# Altium schematic sheet Power.SchDoc
size A4
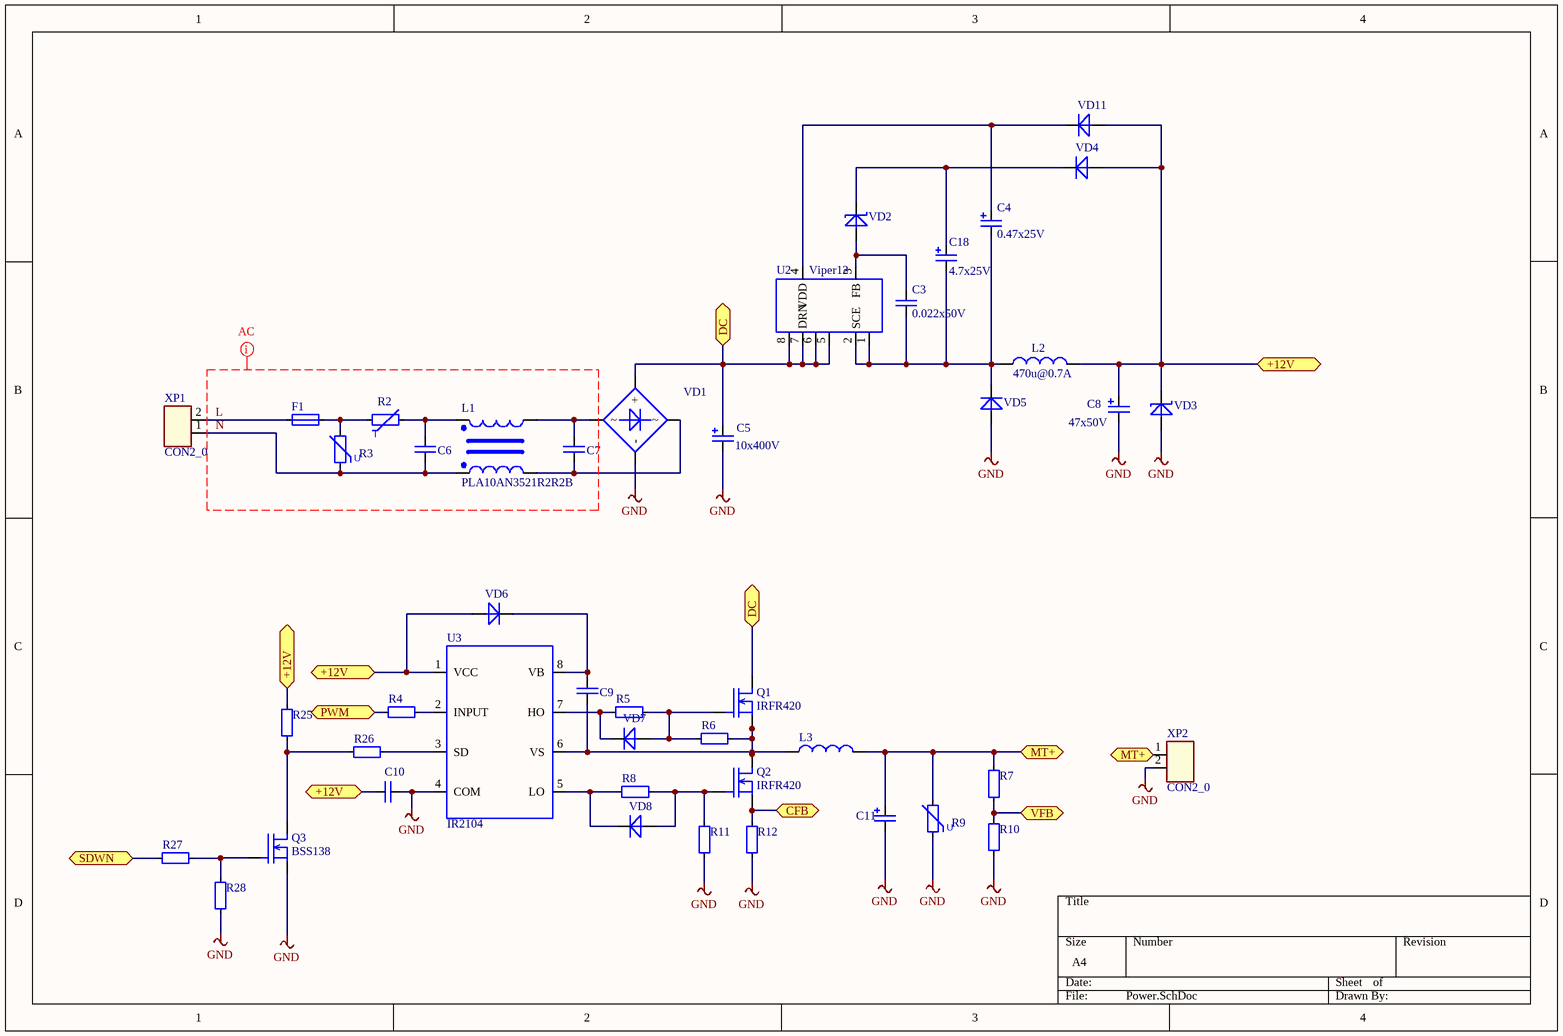
[diagram p0: Power.SchDoc]

## Parts
C3  0.022x50V  [SMD_0805]
C4  0.47x25V  [CAPR-5/2.5]
C5  10x400V  [CAPR-10/5]
C6  (no value)  [MKR-X2-0.22-10]
C7  (no value)  [MKR-X2-0.22-10]
C8  47x50V  [CAPR-5/2.5]
C9  (no value)  [SMD_0805]
C10  (no value)  [SMD_0805]
C11  (no value)  [CAPR-5/2.5]
C18  4.7x25V  [CAPR-5/2.5]
F1  (no value)  [KLS-1009]
L1  PLA10AN3521R2R2B  [PLA10AN3521R2R2B]
L2  470u@0.7A  [IND-DV0470.00K]
L3  (no value)  [IND-DV0470.00K]
Q1  IRFR420  [TO-252]
Q2  IRFR420  [TO-252]
Q3  BSS138  [SOT23-3PIN]
R2  RES NTC  [NTC-5mm]  (value not drawn)
R3  RES VARISTOR  [VAR-10D]  (value not drawn)
R4  (no value)  [SMD_0805]
R5  (no value)  [SMD_0805]
R6  (no value)  [SMD_0805]
R7  (no value)  [SMD_0805]
R8  (no value)  [SMD_0805]
R9  RES VARISTOR  [VAR-05D]  (value not drawn)
R10  (no value)  [SMD_0805]
R11  (no value)  [SMD_0805]
R12  (no value)  [SMD_0805]
R25  (no value)  [SMD_0805]
R26  (no value)  [SMD_0805]
R27  (no value)  [SMD_0805]
R28  (no value)  [SMD_0805]
U2  Viper12  [SO8-150mil]
U3  IR2104  [SO8-150mil]
VD1  DIODE BRIDGE  [GBU BRIDGE]  (value not drawn)
VD2  (no value)  [SOD-123]
VD3  (no value)  [SOD-123]
VD4  (no value)  [DO214-AC]
VD5  (no value)  [DO214-AC]
VD6  (no value)  [DO214-AC]
VD7  (no value)  [DIO-MELF_SOD-80]
VD8  (no value)  [DIO-MELF_SOD-80]
VD11  (no value)  [DO214-AC]
XP1  CON2_0  [SCREW_TERM-5.0/2]
XP2  CON2_0  [SCREW_TERM-5.0/2]

## Ports
+12V, CFB, DC, MT+, PWM, SDWN, VFB

## Nets
GND: C5.2 C8.2 C10.2 C11.2 Q3.2(S) R9.1 R10.1 R11.2 R12.2 R28.1 U3.4(COM) VD1.4(-) VD3.2(A) VD5.2(A) XP2.2
+12V: C8.1 C10.1 L2.2 R25.2 U3.1(VCC) VD3.1(C) VD4.2(A) VD6.2(A) VD11.2(A) ; port +12V
CFB: Q2.3(D) R12.1 ; port CFB
DC: C5.1 Q1.2(S) U2.5(DRN) U2.6(DRN) U2.7(DRN) U2.8(DRN) VD1.1(+) ; port DC
L: F1.2 XP1.2
MT+: C11.1 L3.2 R7.2 R9.2 XP2.1 ; port MT+
N: C6.2 L1.1 R3.1 XP1.1
PWM: R4.1 ; port PWM
SDWN: R27.2 ; port SDWN
VFB: R7.1 R10.2 ; port VFB
NetC3_1: C3.1 U2.3(FB) VD2.2(A)
NetC3_2: C3.2 C4.2 C18.2 L2.1 U2.1(SCE) U2.2(SCE) VD5.1(C)
NetC4_1: C4.1 U2.4(VDD) VD11.1(C)
NetC6_1: C6.1 L1.4 R2.2
NetC7_1: C7.1 L1.3 VD1.2
NetC7_2: C7.2 L1.2 VD1.3
NetC9_1: C9.1 U3.8(VB) VD6.1(C)
NetC9_2: C9.2 L3.1 Q1.3(D) Q2.2(S) R6.2 U3.6(VS)
NetC18_1: C18.1 VD2.1(C) VD4.1(C)
NetF1_1: F1.1 R2.1 R3.2
NetQ1_1: Q1.1(G) R5.1 R6.1 VD7.2(A)
NetQ2_1: Q2.1(G) R8.1 R11.1 VD8.2(A)
NetQ3_1: Q3.1(G) R27.1 R28.2
NetQ3_3: Q3.3(D) R25.1 R26.1
NetR4_2: R4.2 U3.2(INPUT)
NetR5_2: R5.2 U3.7(HO) VD7.1(C)
NetR8_2: R8.2 U3.5(LO) VD8.1(C)
NetR26_2: R26.2 U3.3(SD)

## Layout directives
AC Input: Undefined: L, N

## Notes on the sheet
- (in symbol RES NTC) T
- (in symbol RES VARISTOR) U

## Library data of the parts
C3 C6 C7 C9 C10 = C_NONE_POLAR: None polar capacitor
  C3: Value: 0.022x50V
C4 C5 C8 C11 C18 = C_POLAR: Polar capacitor
  C4: Value: 0.47x25V
  C5: Value: 10x400V
  C8: Value: 47x50V
  C18: Value: 4.7x25V
F1 = FUSE: Resistor
L1 = Inductor Sin
L2 L3 = INDUCTOR
  L2: Value: 470u@0.7A
Q1 Q2 = IRFR420: IG-FET N-Channel; Manufacture: Vishay; Model: IRFR420; HelpURL: https://www.rcscomponents.com/datasheets/irfr420pbf.pdf; Case: TO-252
Q3 = BSS138: IG-FET N-Channel; Manufacture: Fairchild; Model: BSS138; HelpURL: https://cdn.sparkfun.com/datasheets/BreakoutBoards/BSS138.pdf; Case: SOT-23
R4-R8 R10-R12 R25-R28 = RES: Resistor
U2 = Viper12: Step-Down Converter; Manufacturer: STMicro; Model: Viper12-A; HelpURL: http://www.st.com/content/st_com/en/products/power-management/ac-dc-converters/high-voltage-converters/viper/viper12a-e.html
VD2 VD3 = ZENER: Zener diode
VD4-VD8 VD11 = DIODE: Case: *